# Altium schematic sheet CTRL.SchDoc: =ProjectName
size 420 x 297 mm; Author: SBH; CompanyName: WUT; DrawnBy: SBH; Organization: ISE-WUT; Address1: Warsaw Univeristy of Technology; Address2: Nowowiejska 15/19; DocumentNumber: 11; Revision: -; SheetNumber: 11; SheetTotal: 12; EDA_Number: ARTIQ; Projet: eRTM15 Baikal; ModifiedBy: -; CreateDate: XX/XX/XXXX; CheckedDate: -; Title2: CTRL.SchDoc; DivGrp: ISE; Designer: SBH; ModifiedDate: -; ProjectName: eRTM15 Baikal
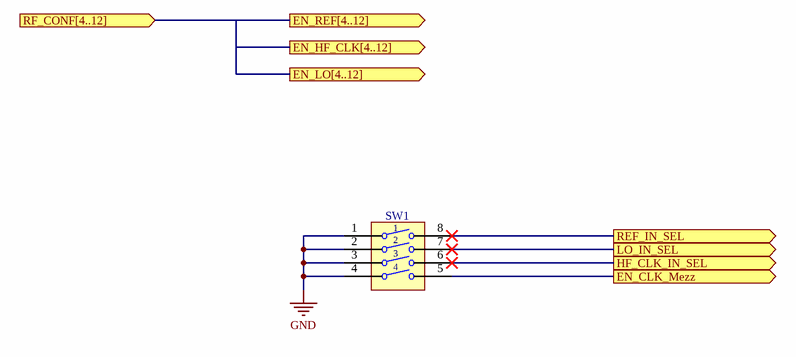
[diagram p0: CTRL.SchDoc]

## Parts
SW1  Switch  [SW_CTS_219-4MST]  (value not drawn)

## Ports
EN_CLK_Mezz (out), EN_HF_CLK[4..12] (out), EN_LO[4..12] (out), EN_REF[4..12] (out), HF_CLK_IN_SEL (out), LO_IN_SEL (out), REF_IN_SEL (out), RF_CONF[4..12] (in)

## Nets
GND: SW1.1 SW1.2 SW1.3 SW1.4
EN_CLK_Mezz: SW1.5 ; port EN_CLK_Mezz
HF_CLK_IN_SEL: SW1.6 ; port HF_CLK_IN_SEL
LO_IN_SEL: SW1.7 ; port LO_IN_SEL
REF_IN_SEL: SW1.8 ; port REF_IN_SEL

## Buses and harness runs
bus port EN_HF_CLK[4..12] = port EN_LO[4..12] = port EN_REF[4..12] = port RF_CONF[4..12]

## Notes on the sheet
- Project/Equipment
- Document
- Designer
- Drawn by
- Check.by
- File
- Last Mod.
- Print Date
- Sheet
- Size
- A3
- of
- Rev

## Library data of the parts
SW1 = SW_CTS_219-4MST: 4 Ways SPST DIP Switch; Part Description: 4 Ways, Pitch 2.54mm, SPST DIP Switch, Rating 100mA 50VDC; Manufacturer: CTS ELECTROCOMPONENTS; PressFit: No; Part Number: SW_CTS_219-4MST; Component Kind: Standard; Component Type: Standard; Pin Count: 8; PackageDescription: Pitch 2.54mm, Body 6.7 x 11.63mm, 4 Ways SPST Surface-Mounting DIP Switch, CTS 219 Series; Family: Switch; Mounted: Yes; Socket: No; SMD: Yes; Sense: No; Status: None; Manufacturer Part Number: 219-4MST; ComponentHeight: 2.23mm; HelpURL: \\cern.ch\dfs\Applications\Altium\Datasheets\SW_CTS_219-4MST.pdf; Author: CERN DEM JLC; CreateDate: 2014-11-17; LatestRevisionDate: 2014-11-17